# Altium schematic sheet Boost.SchDoc
size A4; SheetNumber: 2; SheetTotal: 1
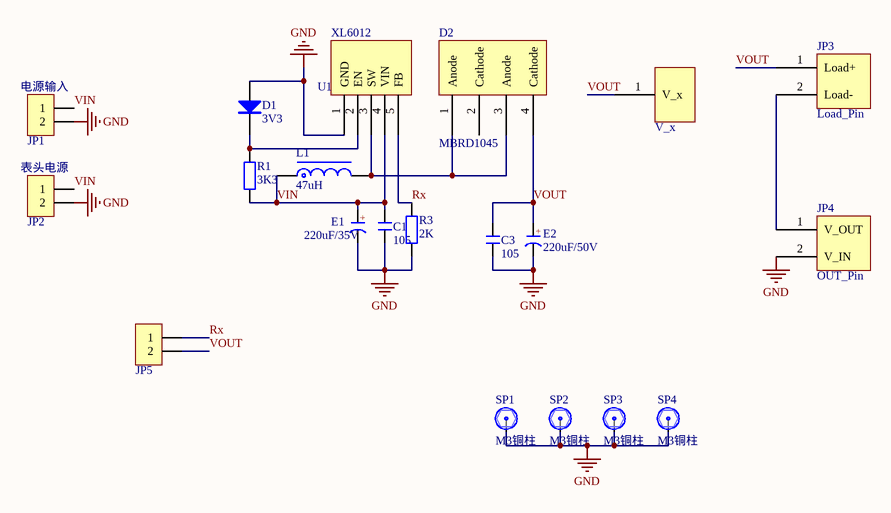
[diagram p0: Boost.SchDoc]

## Parts
*  V_x  [PCBComponent_1]
C1  105  [C 0603_L]
C3  105  [C 0603_L]
D1  3V3  [SOD-123]
D2  MBRD1045  [TO-252]
E1  220uF/35V  [CAPAER_D080_L125_P035]
E2  220uF/50V  [CAPAER_D100_L130_P055]
JP1  HDR-1X2  [HDR2.54-LI-2P]  (value not drawn)
JP2  HDR-1X2  [HDR2.54-LI-2P]  (value not drawn)
JP3  Load_Pin  [connect]
JP4  OUT_Pin  [connect]
JP5  HDR-1X2  [HDR2.54-LI-2P]  (value not drawn)
L1  47uH  [CD127]
R1  3K3  [R 0603_L]
R3  2K  [R 0603_L]
SP1  M3铜柱  [M3x4+6_L]
SP2  M3铜柱  [M3x4+6_L]
SP3  M3铜柱  [M3x4+6_L]
SP4  M3铜柱  [M3x4+6_L]
XL6012  U1  [T220-5]

## Nets
GND: C1.2 C3.2 D1.1(A) E1.2(K) E2.2(K) JP1.2 JP2.2 JP4.2(V_IN) R3.1 SP1.1 SP2.1 SP3.1 SP4.1 XL6012.1(GND)
Rx: JP5.1 R3.2 XL6012.5(FB)
VIN: C1.1 E1.1(A) JP1.1 JP2.1 L1.1 R1.2 XL6012.4(VIN)
VOUT: *.1(V_x) C3.1 D2.4(Cathode) E2.1(A) JP3.1(Load+) JP5.2
NetD1_2: D1.2(K) R1.1 XL6012.2(EN)
NetD2_1: D2.1(Anode) D2.3(Anode) L1.2 XL6012.3(SW)
NetJP3_2: JP3.2(Load-) JP4.1(V_OUT)

Not connected (* = marked no-connect by the designer): D2 2(Cathode)

## Notes on the sheet
- (near JP1) 电源输入
- (near JP2) 表头电源
- (in symbol C-CAP) +

## Library data of the parts
C1 C3 = C: 无极性贴片电容; 版权归属: 源创客; BOM名称: 无极性贴片电容; 学习资源: www.ooocke.com
D1 = 1N4007: 整流二极管; 版权归属: 源创客; BOM名称: 整流二极管; 学习资源: www.ooocke.com
E1 E2 = C-CAP: 直插电解电容; 版权归属: 源创客; BOM名称: 直插电解电容; 学习资源: www.ooocke.com
JP1 JP2 JP5 = Header 2: 2P接插件; 版权归属: 源创客; BOM名称: 2P接插件; 学习资源: www.ooocke.com
L1 = L-CD: 贴片功率电感; BOM名称: 功率电感; 版权归属: 源创客; 学习资源: www.ooocke.com
R1 R3 = R: 贴片电阻; 版权归属: 源创客; BOM名称: 贴片电阻; 学习资源: www.ooocke.com
SP1-SP4 = 铜柱加头小焊盘: 铜柱; 版权归属: 源创客; BOM名称: 铜柱; 学习资源: www.ooocke.com
XL6012 = XL6012